# EAGLE schematic his_masters_noise (EAGLE 9.3.0)
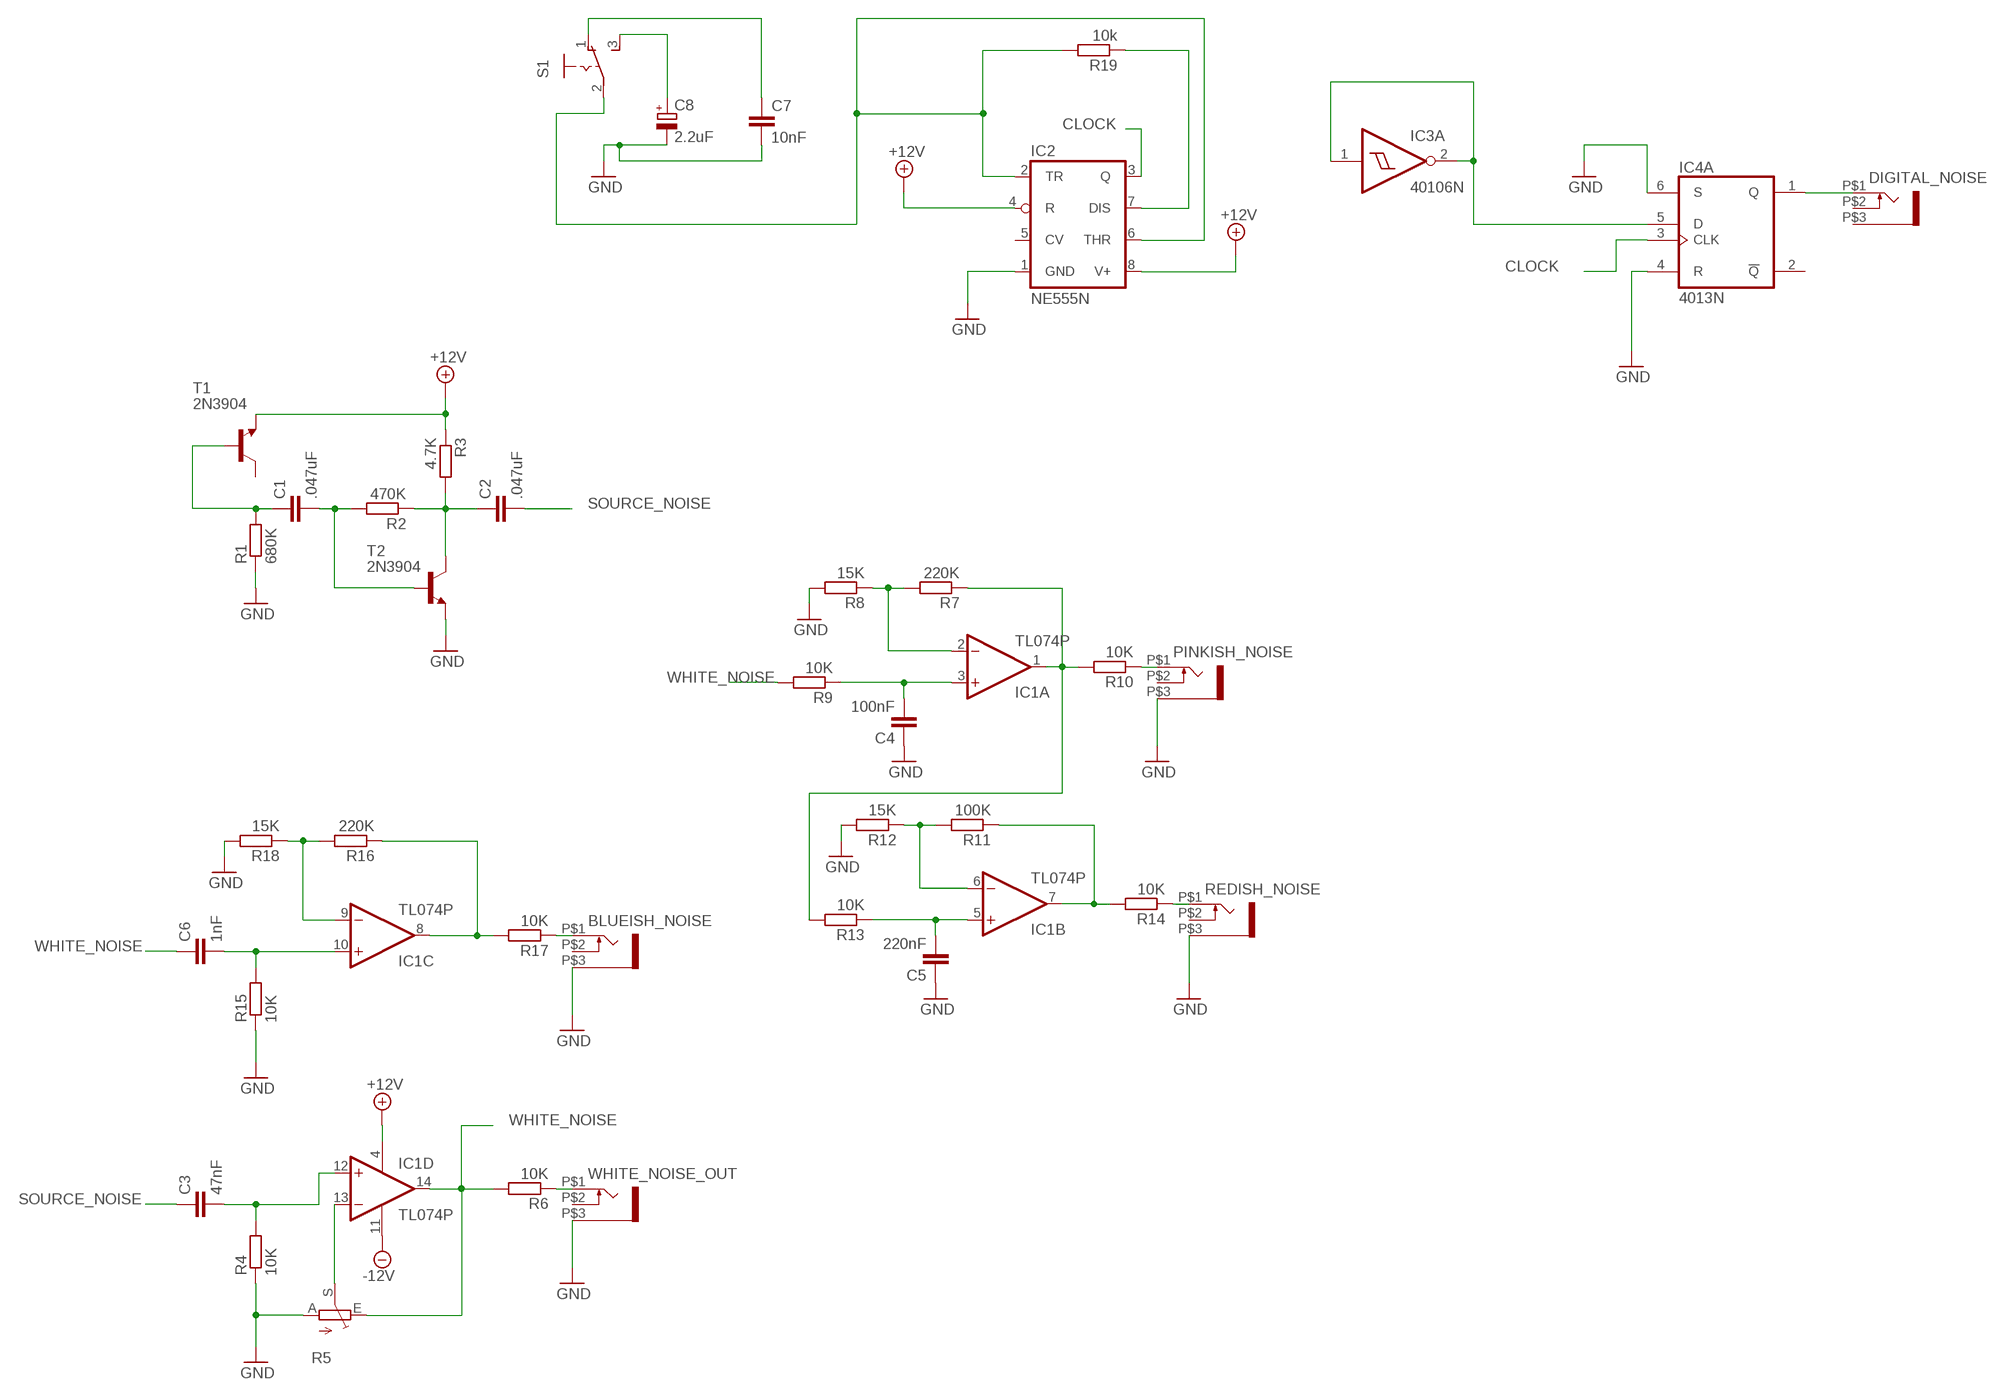
[diagram p0: schematic, sheet 1]

## Parts
BLUEISH_NOISE  WQP-PJ301M-12_JACK  [WQP-PJ301M-12_JACK]
C1  .047uF  C-EU025-030X050  [C025-030X050]
C2  .047uF  C-EU025-030X050  [C025-030X050]
C3  47nF  C-EU025-030X050  [C025-030X050]
C4  100nF  C-EU025-030X050  [C025-030X050]
C5  220nF  C-EU025-030X050  [C025-030X050]
C6  1nF  C-EU025-030X050  [C025-030X050]
C7  10nF  C-EU025-025X050  [C025-025X050]
C8  2.2uF  CPOL-EUE1.8-4  [E1,8-4]
DIGITAL_NOISE  WQP-PJ301M-12_JACK  [WQP-PJ301M-12_JACK]
IC1  TL074P  [DIL14]
IC2  NE555N  [DIL08]
IC3  40106N  [DIL14]
IC4  4013N  [DIL14]
PINKISH_NOISE  WQP-PJ301M-12_JACK  [WQP-PJ301M-12_JACK]
R1  680K  R-EU_0204/7  [0204/7]
R2  470K  R-EU_0204/7  [0204/7]
R3  4.7K  R-EU_0204/7  [0204/7]
R4  10K  R-EU_0204/7  [0204/7]
R5  TRIM_EU-S64W  [S64W]
R6  10K  R-EU_0204/7  [0204/7]
R7  220K  R-EU_0204/7  [0204/7]
R8  15K  R-EU_0204/7  [0204/7]
R9  10K  R-EU_0204/7  [0204/7]
R10  10K  R-EU_0204/7  [0204/7]
R11  100K  R-EU_0204/7  [0204/7]
R12  15K  R-EU_0204/7  [0204/7]
R13  10K  R-EU_0204/7  [0204/7]
R14  10K  R-EU_0204/7  [0204/7]
R15  10K  R-EU_0204/7  [0204/7]
R16  220K  R-EU_0204/7  [0204/7]
R17  10K  R-EU_0204/7  [0204/7]
R18  15K  R-EU_0204/7  [0204/7]
R19  10k  R-EU_0204/7  [0204/7]
REDISH_NOISE  WQP-PJ301M-12_JACK  [WQP-PJ301M-12_JACK]
S1  255SB  [255SB]
T1  2N3904  [TO92]
T2  2N3904  [TO92]
WHITE_NOISE_OUT  WQP-PJ301M-12_JACK  [WQP-PJ301M-12_JACK]

## Nets
+12V: IC1.4(P:V+) IC2.4(R) IC2.8(V+) R3.1 T1.3(E)
-12V: IC1.11(P:V-)
CLOCK: IC2.3(Q) IC4.3(A:CLK)
GND: BLUEISH_NOISE.P$3 C4.1 C5.1 C7.2 C8.- IC2.1(GND) IC4.4(A:R) IC4.6(A:S) PINKISH_NOISE.P$3 R1.1 R4.1 R5.A R8.2 R12.2 R15.1 R18.2 REDISH_NOISE.P$3 T2.3(E) WHITE_NOISE_OUT.P$3
N$1: C1.1 R1.2 T1.2(B)
N$2: C1.2 R2.2 T2.2(B)
N$3: C2.1 R2.1 R3.2 T2.1(C)
N$4: C3.2 IC1.12(D:+IN) R4.2
N$5: IC1.13(D:-IN) R5.S
N$6: R6.1 WHITE_NOISE_OUT.P$1
N$7: IC1.1(A:OUT) R7.1 R10.2 R13.2
N$8: C4.2 IC1.3(A:+IN) R9.1
N$9: IC1.2(A:-IN) R7.2 R8.1
N$10: PINKISH_NOISE.P$1 R10.1
N$11: C5.2 IC1.5(B:+IN) R13.1
N$12: IC1.6(B:-IN) R11.2 R12.1
N$13: IC1.7(B:OUT) R11.1 R14.2
N$14: R14.1 REDISH_NOISE.P$1
N$15: C6.2 IC1.10(C:+IN) R15.2
N$16: IC2.2(TR) IC2.6(THR) R19.2 S1.2(P)
N$17: BLUEISH_NOISE.P$1 R17.1
N$18: IC2.7(DIS) R19.1
N$19: IC1.9(C:-IN) R16.2 R18.1
N$20: C7.1 S1.1(O)
N$21: C8.+ S1.3(S)
N$22: DIGITAL_NOISE.P$1 IC4.1(A:Q)
N$24: IC3.1(A:I) IC3.2(A:O) IC4.5(A:D)
SOURCE_NOISE: C2.2 C3.1
WHITE_NOISE: C6.1 IC1.8(C:OUT) IC1.14(D:OUT) R5.E R6.2 R9.2 R16.1 R17.2
Unconnected: BLUEISH_NOISE.P$2 DIGITAL_NOISE.P$2 DIGITAL_NOISE.P$3 IC2.5(CV) IC3.3(B:I) IC3.4(B:O) IC3.5(C:I) IC3.6(C:O) IC3.8(D:O) IC3.9(D:I) IC3.10(E:O) IC3.11(E:I) IC3.12(F:O) IC3.13(F:I) IC4.2(A:!Q) IC4.8(B:S) IC4.9(B:D) IC4.10(B:R) IC4.11(B:CLK) IC4.12(B:!Q) IC4.13(B:Q) PINKISH_NOISE.P$2 REDISH_NOISE.P$2 T1.1(C) WHITE_NOISE_OUT.P$2

## Power pins joined to a net without a drawn wire
VDD: IC3.14(P:VDD) IC4.14(P:VDD)
VSS: IC3.7(P:VSS) IC4.7(P:VSS)

## Library data of the parts
BLUEISH_NOISE DIGITAL_NOISE PINKISH_NOISE REDISH_NOISE WHITE_NOISE_OUT = thonkiconn:WQP-PJ301M-12_JACK
C1-C7 = rcl:C-EU: CAPACITOR, European symbol; SPICEPREFIX: C
C8 = rcl:CPOL-EU: POLARIZED CAPACITOR, European symbol; SPICEPREFIX: C
IC1 = linear:TL074: OP AMP
IC2 = linear:*555: TIMER
IC3 = 40xx:40106: Hex SCHMITT TRIGGER
IC4 = 40xx:4013: Dual D FLIP FLOP, set/reset
R1-R4 R6-R19 = rcl:R-EU_: RESISTOR, European symbol; SPICEPREFIX: R
R5 = pot:TRIM_EU-: POTENTIOMETER
S1 = switch:255SB: SLIDING SWITCH Distributor Buerklin, 11G810
T1 T2 = transistor:2N3904: NPN TRANSISTOR